# EAGLE design 7segement4digits1badidea-feathershield-mk-1.1 (EAGLE 7.5.0)
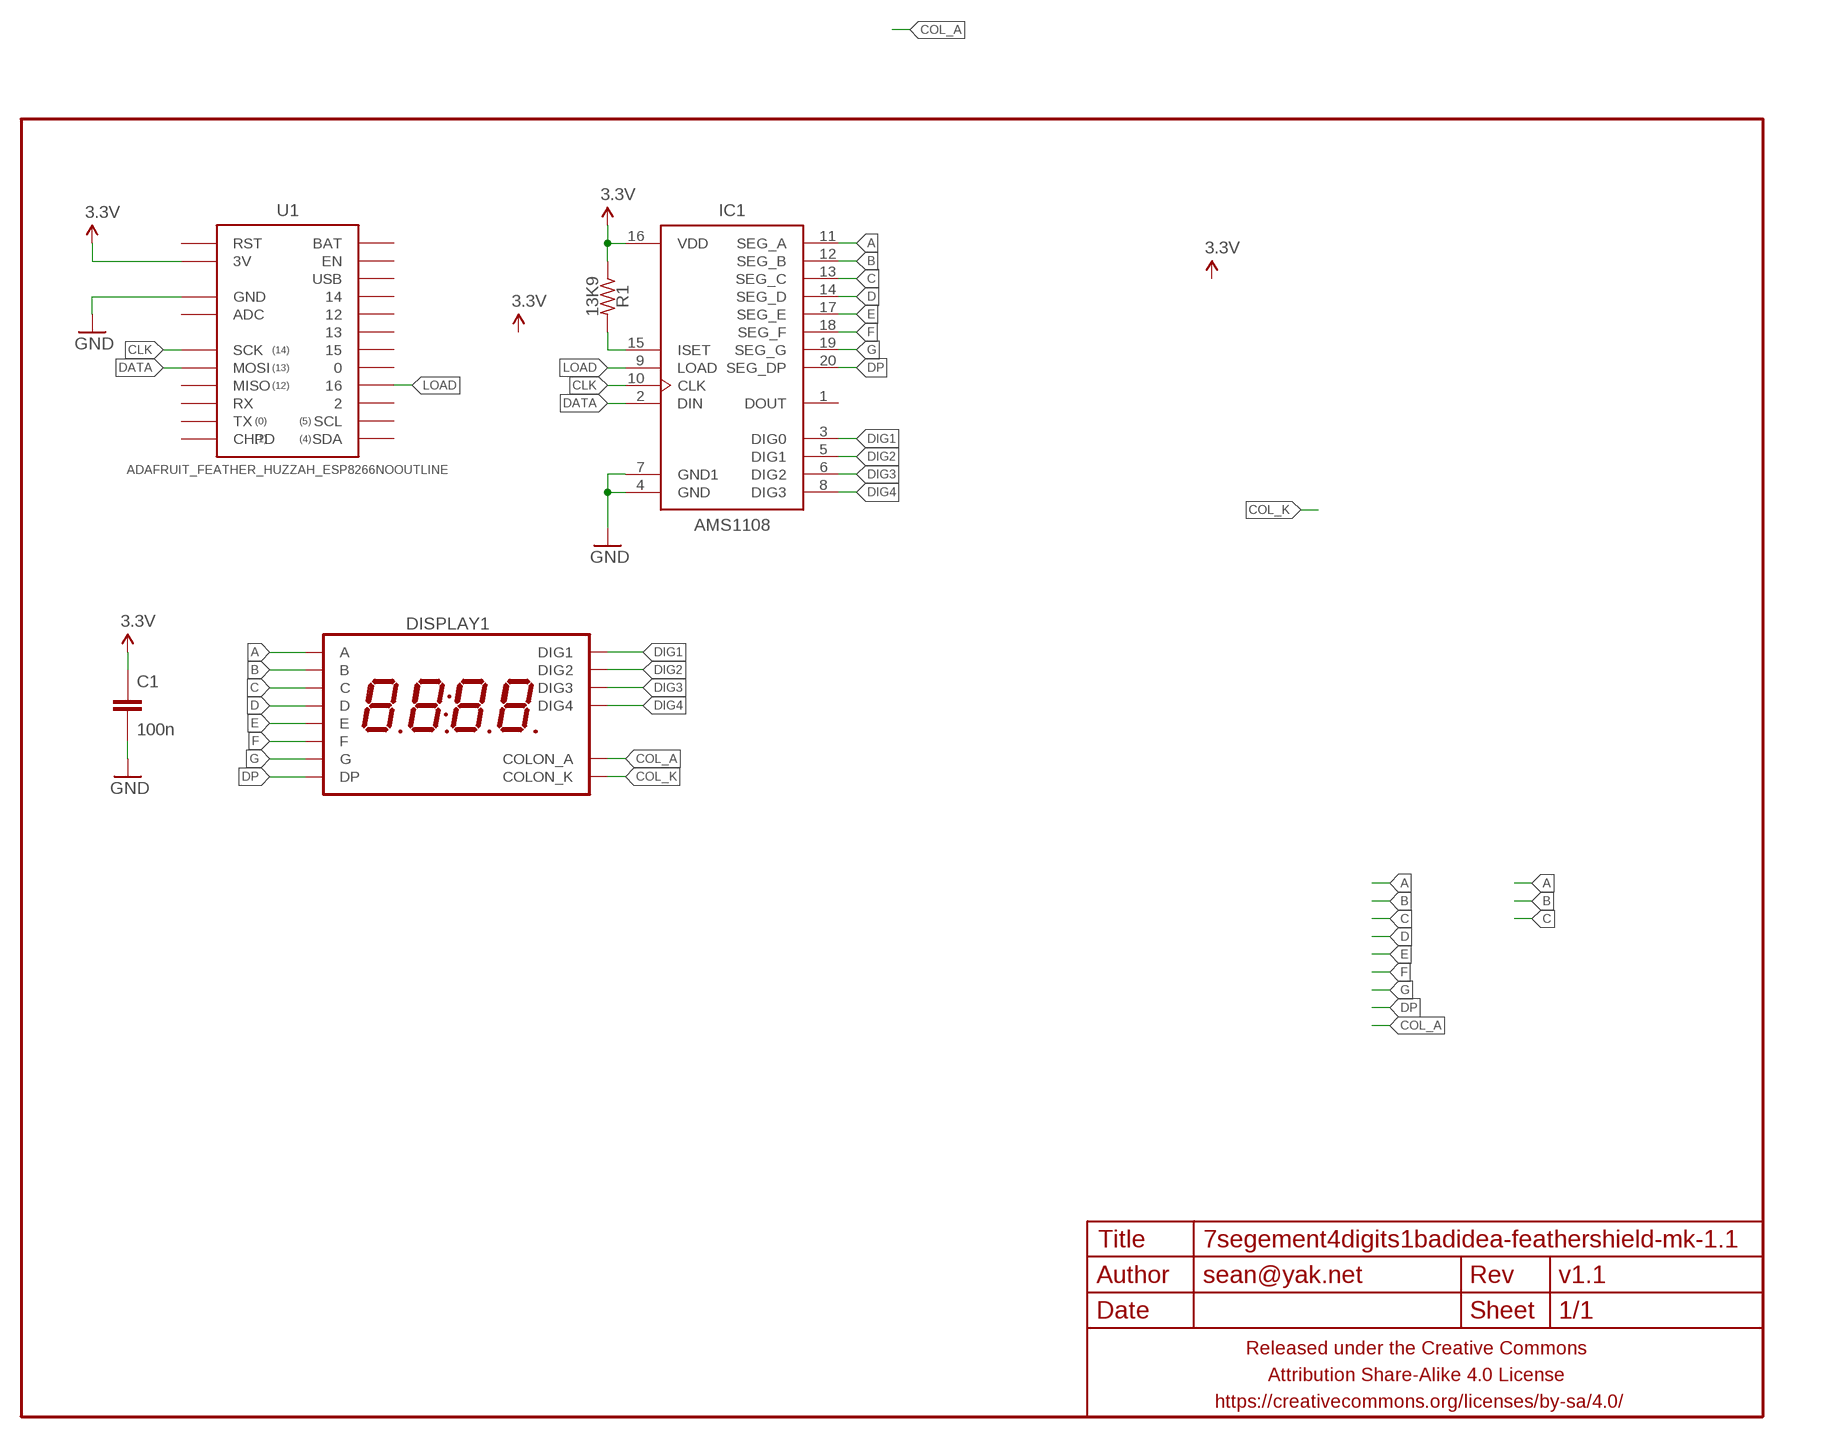
[diagram p0: schematic, sheet 1]

## Parts
C1  100n  CAPACITOR-CERAMICC0603  [C0603]
DISPLAY1  7SEG_4DIGIT_COLON14.2MM-CC  [7SEG_4DIG_0.56IN_14MM_ADAFRUIT]
FRAME1  FRAME-LETTERNO_PACKAGE  [DUMMY]
IC1  AMS1108  AMS1108SOIC-20W  [SO20W-NOSUCK]
R1  13K9  RESISTORR0603  [R0603]
U1  ADAFRUIT_FEATHER_HUZZAH_ESP8266NOOUTLINE  [ADAFRUIT_FEATHER_HUZZAH_NOOUTLINE]

## Nets
3.3V: C1.1 IC1.16(VDD) R1.1 U1.3V
A: DISPLAY1.P$13(A) IC1.11(SEG_A)
B: DISPLAY1.P$9(B) IC1.12(SEG_B)
C: DISPLAY1.P$4(C) IC1.13(SEG_C)
CLK: IC1.10(CLK) U1.SCK
COL_A: DISPLAY1.P$8(COLON_A)
COL_K: DISPLAY1.P$7(COLON_K)
D: DISPLAY1.P$2(D) IC1.14(SEG_D)
DATA: IC1.2(DIN) U1.MOSI
DIG1: DISPLAY1.P$14(DIG1) IC1.3(DIG0)
DIG2: DISPLAY1.P$11(DIG2) IC1.5(DIG1)
DIG3: DISPLAY1.P$10(DIG3) IC1.6(DIG2)
DIG4: DISPLAY1.P$6(DIG4) IC1.8(DIG3)
DP: DISPLAY1.P$3(DP) IC1.20(SEG_DP)
E: DISPLAY1.P$1(E) IC1.17(SEG_E)
F: DISPLAY1.P$12(F) IC1.18(SEG_F)
G: DISPLAY1.P$5(G) IC1.19(SEG_G)
GND: C1.2 IC1.4(GND) IC1.7(GND1) U1.GND@0(GND)
LOAD: IC1.9(LOAD) U1.16
N$1: IC1.15(ISET) R1.2
Unconnected: IC1.1(DOUT) U1.0 U1.2 U1.12 U1.13 U1.14 U1.15 U1.ADC U1.BAT U1.CHPD U1.EN U1.MISO U1.RST U1.RX U1.SCL U1.SDA U1.TX U1.USB

## Library data of the parts
C1 = A_butts:CAPACITOR-CERAMIC: CAPACITOR, European symbol
DISPLAY1 = a_parts:7SEG_4DIGIT_COLON
FRAME1 = A_butts:FRAME-LETTER: Schematic Frame Standard 8.5x11 US Letter frame; DESIGNER: sean@yak.net; VERSION: v1.1
IC1 = a_parts:AMS1108
R1 = a_parts:RESISTOR: RESISTOR, American symbol
U1 = a_parts:ADAFRUIT_FEATHER_HUZZAH_ESP8266

## Board
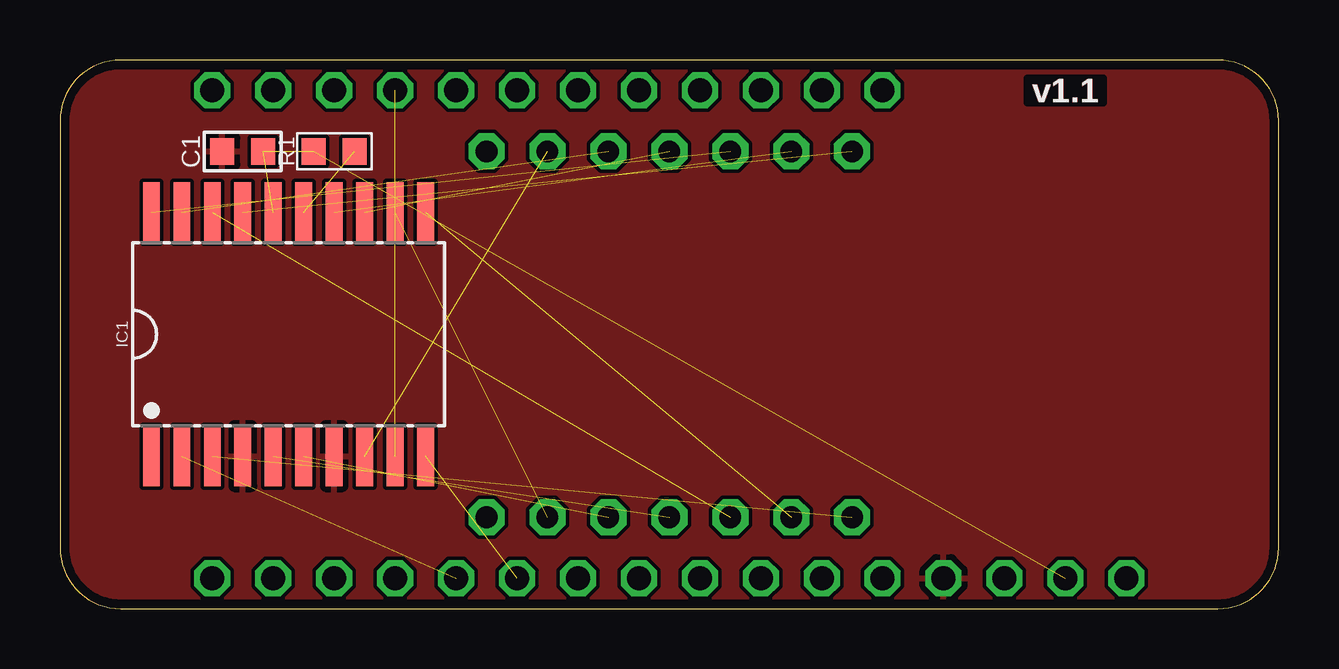
[diagram p1: board, top side]
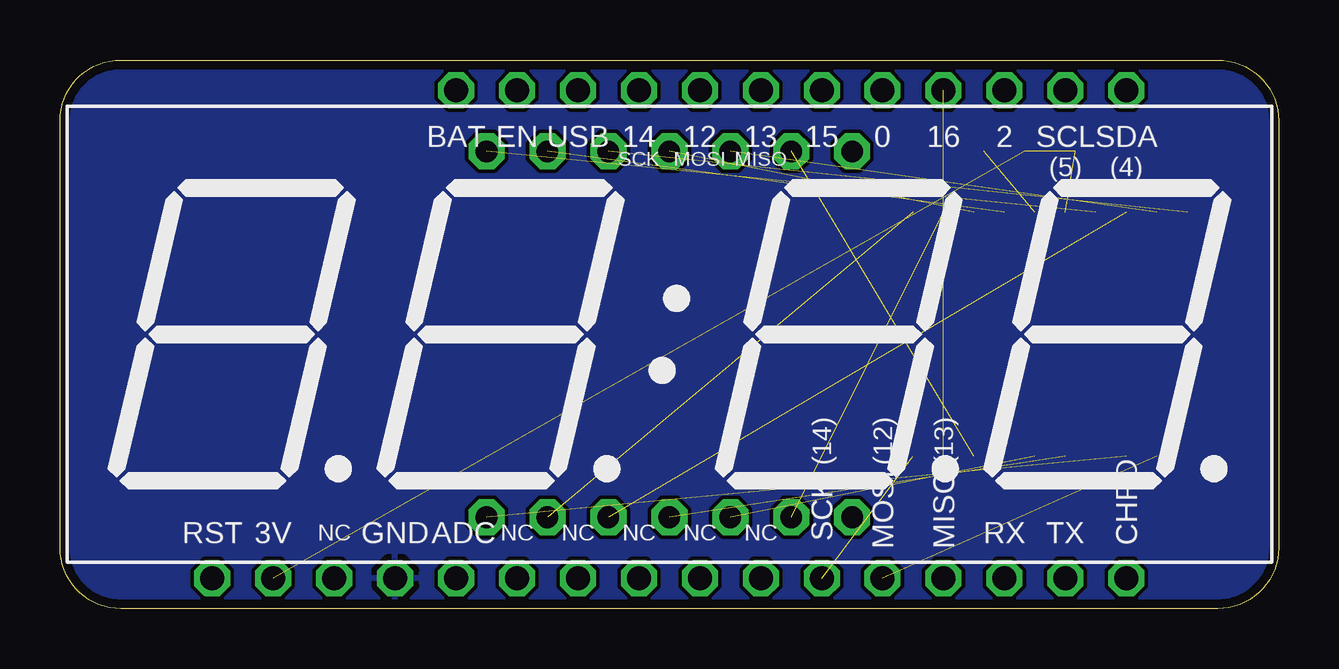
[diagram p2: board, bottom side, seen from below]

Size 50.8 x 22.86 mm. Coordinates in mm from the lower left corner, seen from the top.
Outline: 0,20.32 0,2.54 arc90 2.54,0 48.26,0 arc90 50.8,2.54 50.8,20.32 arc90 48.26,22.86 2.54,22.86 arc90 0,20.32
Copper layers (1*16): Top 0.0356mm / dielectric 1.5011mm / Bottom 0.0356mm
Design rules "LaenPCBOrder_2": minimum track width 6mil, minimum drill 13mil, track to track 6mil, track to pad 6mil, pad to pad 6mil, via to via 6mil, smd to smd 6mil, copper to edge 15mil, drill to drill 6mil, minimum pad ring 7mil, minimum via ring 7mil, stop-mask expansion 3mil, vias tented up to drill 20mil, thermal gap 10mil

### Footprints (pad centres in the part's own frame; a part is rotated, then mirrored left to right if it is on the bottom)
C0603 = smd 1 x 1.1: 1 -0.85,0; 2 0.85,0
7SEG_4DIG_0.56IN_14MM_ADAFRUIT = drill 0.9 pad 1.5 octagon: P$1 -7.62,7.62; P$2 -5.08,7.62; P$3 -2.54,7.62; P$4 0,7.62; P$5 2.54,7.62; P$6 5.08,7.62; P$7 7.62,7.62; P$8 7.62,-7.62; P$9 5.08,-7.62; P$10 2.54,-7.62; P$11 0,-7.62; P$12 -2.54,-7.62; P$13 -5.08,-7.62; P$14 -7.62,-7.62
SO20W-NOSUCK = smd 0.7 x 2.5: 1 -5.715,-5.08; 2 -4.445,-5.08; 3 -3.175,-5.08; 4 -1.905,-5.08; 5 -0.635,-5.08; 6 0.635,-5.08; 7 1.905,-5.08; 8 3.175,-5.08; 9 4.445,-5.08; 10 5.715,-5.08; 11 5.715,5.08; 12 4.445,5.08; 13 3.175,5.08; 14 1.905,5.08; 15 0.635,5.08; 16 -0.635,5.08; 17 -1.905,5.08; 18 -3.175,5.08; 19 -4.445,5.08; 20 -5.715,5.08
R0603 = smd 1 x 1.1: 1 -0.85,0; 2 0.85,0
ADAFRUIT_FEATHER_HUZZAH_NOOUTLINE = drill 1 pad 1.5 octagon: 0 8.89,10.16; 2 13.97,10.16; 3V -16.51,-10.16; 12 1.27,10.16; 13 3.81,10.16; 14 -1.27,10.16; 15 6.35,10.16; 16 11.43,10.16; ADC -8.89,-10.16; BAT -8.89,10.16; CHPD 19.05,-10.16; EN -6.35,10.16; GND@0 -11.43,-10.16; MISO 11.43,-10.16; MOSI 8.89,-10.16; NC@3 -13.97,-10.16; NC@6 -6.35,-10.16; NC@7 -3.81,-10.16; NC@8 -1.27,-10.16; NC@9 1.27,-10.16; NC@10 3.81,-10.16; RST -19.05,-10.16; RX 13.97,-10.16; SCK 6.35,-10.16; SCL 16.51,10.16; SDA 19.05,10.16; TX 16.51,-10.16; USB -3.81,10.16

### Placement (x,y rotation side)
C1  7.62,19.05 180 top
DISPLAY1  25.4,11.43 0 bottom
FRAME1  0,-0.5 0 top
IC1  9.53,11.43 0 top
R1  11.43,19.05 0 top
U1  25.4,11.43 0 bottom

### Tracks (layer width: path | path; a pad name or v marks a point on that pad's centre or on a via)
3.3V  (3 unrouted)
A  (1 unrouted)
B  (1 unrouted)
C  (1 unrouted)
CLK  (1 unrouted)
D  (1 unrouted)
DATA  (1 unrouted)
DIG1  (1 unrouted)
DIG2  (1 unrouted)
DIG3  (1 unrouted)
DIG4  (1 unrouted)
DP  (1 unrouted)
E  (1 unrouted)
F  (1 unrouted)
G  (1 unrouted)
GND
  pour Top: 48.26,0 2.54,0 arc-90 0,2.54 0,20.32 arc-90 2.54,22.86 48.26,22.86 arc-90 50.8,20.32 50.8,2.54 arc-90
  pour Bottom: 50.8,20.32 50.8,2.54 arc-90 48.26,0 2.54,0 arc-90 0,2.54 0,20.32 arc-90 2.54,22.86 48.26,22.86 arc-90
LOAD  (1 unrouted)
N$1  (1 unrouted)